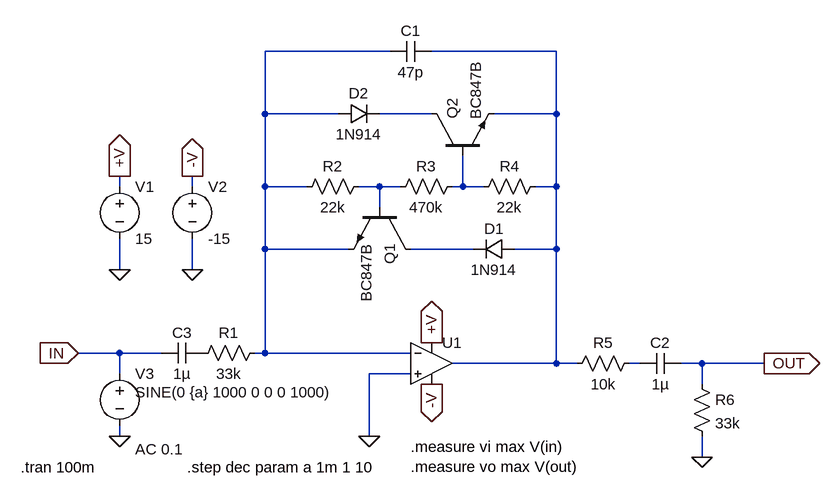
[diagram p0: schematic SimpleComp.asc]
SimpleComp.asc, the LTspice schematic file:
Version 4
SHEET 1 1108 680
WIRE 384 -240 192 -240
WIRE 640 -240 448 -240
WIRE 192 -144 192 -240
WIRE 304 -144 192 -144
WIRE 448 -144 368 -144
WIRE 640 -144 640 -240
WIRE 640 -144 544 -144
WIRE -32 -32 -32 -48
WIRE 80 -32 80 -48
WIRE 192 -32 192 -144
WIRE 256 -32 192 -32
WIRE 368 -32 336 -32
WIRE 400 -32 368 -32
WIRE 496 -32 496 -80
WIRE 496 -32 480 -32
WIRE 528 -32 496 -32
WIRE 640 -32 640 -144
WIRE 640 -32 608 -32
WIRE 368 0 368 -32
WIRE 192 64 192 -32
WIRE 320 64 192 64
WIRE 512 64 416 64
WIRE 640 64 640 -32
WIRE 640 64 576 64
WIRE -32 96 -32 48
WIRE 80 96 80 48
WIRE -32 224 -96 224
WIRE 32 224 -32 224
WIRE 192 224 192 64
WIRE 192 224 176 224
WIRE 416 224 192 224
WIRE 640 240 640 64
WIRE 640 240 480 240
WIRE 672 240 640 240
WIRE 768 240 752 240
WIRE 864 240 832 240
WIRE 960 240 864 240
WIRE -32 256 -32 224
WIRE 416 256 352 256
WIRE 864 272 864 240
WIRE -32 352 -32 336
WIRE 352 352 352 256
WIRE 864 384 864 352
FLAG -32 96 0
FLAG 80 96 0
FLAG 352 352 0
FLAG 864 384 0
FLAG -32 -48 +V
IOPIN -32 -48 Out
FLAG 80 -48 -V
IOPIN 80 -48 Out
FLAG 960 240 OUT
IOPIN 960 240 Out
FLAG 448 272 -V
IOPIN 448 272 Out
FLAG 448 208 +V
IOPIN 448 208 Out
FLAG -32 352 0
FLAG -96 224 IN
IOPIN -96 224 In
SYMBOL Opamps\\UniversalOpamp2 448 240 R0
SYMATTR InstName U1
SYMBOL res 80 240 R270
WINDOW 0 32 56 VTop 0
WINDOW 3 0 56 VBottom 0
SYMATTR InstName R1
SYMATTR Value 33k
SYMBOL res 240 -16 R270
WINDOW 0 32 56 VTop 0
WINDOW 3 0 56 VBottom 0
SYMATTR InstName R2
SYMATTR Value 22k
SYMBOL res 384 -16 R270
WINDOW 0 32 56 VTop 0
WINDOW 3 0 56 VBottom 0
SYMATTR InstName R3
SYMATTR Value 470k
SYMBOL res 512 -16 R270
WINDOW 0 32 56 VTop 0
WINDOW 3 0 56 VBottom 0
SYMATTR InstName R4
SYMATTR Value 22k
SYMBOL res 656 256 R270
WINDOW 0 32 56 VTop 0
WINDOW 3 0 56 VBottom 0
SYMATTR InstName R5
SYMATTR Value 10k
SYMBOL diode 576 48 R90
WINDOW 0 0 32 VBottom 0
WINDOW 3 32 32 VTop 0
SYMATTR InstName D1
SYMATTR Value 1N914
SYMBOL diode 304 -128 R270
WINDOW 0 32 32 VTop 0
WINDOW 3 0 32 VBottom 0
SYMATTR InstName D2
SYMATTR Value 1N914
SYMBOL cap 384 -224 R270
WINDOW 0 32 32 VTop 0
WINDOW 3 0 32 VBottom 0
SYMATTR InstName C1
SYMATTR Value 47p
SYMBOL voltage -32 -48 R0
WINDOW 123 0 0 Left 0
WINDOW 39 0 0 Left 0
SYMATTR InstName V1
SYMATTR Value 15
SYMBOL voltage 80 -48 R0
WINDOW 123 0 0 Left 0
WINDOW 39 0 0 Left 0
SYMATTR InstName V2
SYMATTR Value -15
SYMBOL cap 768 256 R270
WINDOW 0 32 32 VTop 0
WINDOW 3 0 32 VBottom 0
SYMATTR InstName C2
SYMATTR Value 1µ
SYMBOL res 848 256 R0
SYMATTR InstName R6
SYMATTR Value 33k
SYMBOL npn 416 0 R90
SYMATTR InstName Q1
SYMATTR Value BC847B
SYMBOL npn 448 -80 R270
SYMATTR InstName Q2
SYMATTR Value BC847B
SYMBOL cap 96 208 R90
WINDOW 0 0 32 VBottom 0
WINDOW 3 32 32 VTop 0
SYMATTR InstName C3
SYMATTR Value 1µ
SYMBOL voltage -32 240 R0
WINDOW 123 24 132 Left 0
WINDOW 39 0 0 Left 0
WINDOW 3 24 44 Left 0
SYMATTR Value2 AC 0.1
SYMATTR Value SINE(0 {a} 1000 0 0 0 1000)
SYMATTR InstName V3
TEXT 72 400 Left 0 !.step dec param a 1m 1 10
TEXT 416 368 Left 0 !.measure vi max V(in)\n.measure vo max V(out)
TEXT -184 400 Left 0 !.tran 100m

The netlist it stands for:
* SimpleComp.asc
XU1 0 N001 +V -V N002 level.2 Avol=1Meg GBW=10Meg Slew=10Meg ilimit=25m rail=0 Vos=0 phimargin=45 en=0 enk=0 in=0 ink=0 Rin=500Meg  ; pins IN+ IN- V+ V- OUT
R1 P001 N001 33k
R2 N001 N004 22k
R3 N004 N005 470k
R4 N005 N002 22k
R5 N002 N007 10k
D1 N002 N006 1N914
D2 N001 N003 1N914
C1 N001 N002 47p
V1 +V 0 15
V2 -V 0 -15
C2 N007 OUT 1µ
R6 OUT 0 33k
Q1 N006 N004 N001 0 BC847B
Q2 N003 N005 N002 0 BC847B
C3 P001 IN 1µ
V3 IN 0 SINE(0 {a} 1000 0 0 0 1000) AC 0.1
.model D D
.lib standard.dio
.model NPN NPN
.model PNP PNP
.lib standard.bjt
.step dec param a 1m 1 10
.measure vi max V(in)
.measure vo max V(out)
.tran 100m
.lib UniversalOpamps2.sub
.backanno
.end